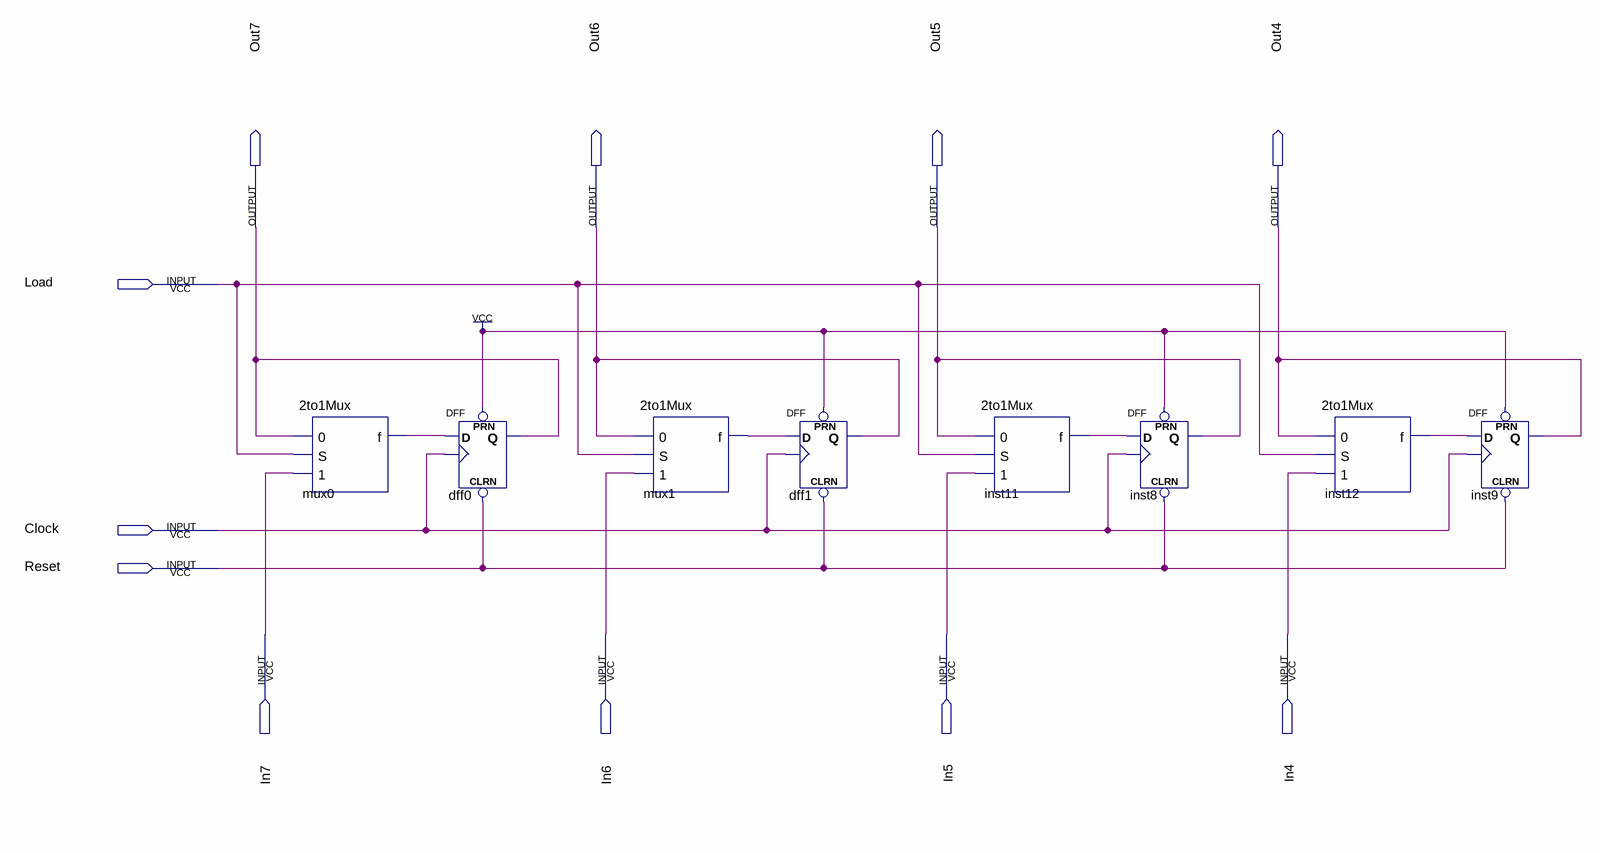
[diagram p0: schematic sheet]
// Quartus schematic 4_Bit_Parallel_Access_Register.bdf as structural Verilog: 8 symbols, 11 pins
module \4_Bit_Parallel_Access_Register  (
  input  Load,
  input  Clock,
  input  Reset,
  input  In7,
  input  In6,
  input  In5,
  input  In4,
  output Out7,
  output Out6,
  output Out5,
  output Out4
);

  wire inst11_f, inst12_f, mux0_f, mux1_f;

  \2to1Mux  mux0 (.\0 (Out7), .S(Load), .\1 (In7), .f(mux0_f));
  DFF dff0 (.CLRN(Reset), .CLK(Clock), .D(mux0_f), .PRN(1'b1), .Q(Out7));
  \2to1Mux  mux1 (.\0 (Out6), .S(Load), .\1 (In6), .f(mux1_f));
  DFF dff1 (.CLRN(Reset), .CLK(Clock), .D(mux1_f), .PRN(1'b1), .Q(Out6));
  \2to1Mux  inst11 (.\0 (Out5), .S(Load), .\1 (In5), .f(inst11_f));
  DFF inst8 (.CLRN(Reset), .CLK(Clock), .D(inst11_f), .PRN(1'b1), .Q(Out5));
  \2to1Mux  inst12 (.\0 (Out4), .S(Load), .\1 (In4), .f(inst12_f));
  DFF inst9 (.CLRN(Reset), .CLK(Clock), .D(inst12_f), .PRN(1'b1), .Q(Out4));
endmodule
